# EAGLE schematic BlingBling v1 (EAGLE 6.1)
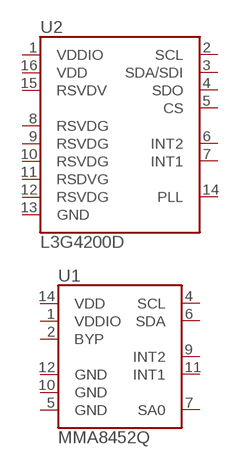
[diagram p0: schematic, sheet 1]

## Parts
U1  MMA8452Q  [QFN-16_0.5MM]
U2  L3G4200D  [LGA16-4X4]
Unconnected: U1.1(VDDIO) U1.2(BYP) U1.4(SCL) U1.5(GND) U1.6(SDA) U1.7(SA0) U1.9(INT2) U1.10(GND) U1.11(INT1) U1.12(GND) U1.14(VDD) U2.1(VDDIO) U2.2(SCL) U2.3(SDA/SDI) U2.4(SDO) U2.5(CS) U2.6(INT2) U2.7(INT1) U2.8(RSVDG) U2.9(RSVDG) U2.10(RSVDG) U2.11(RSDVG) U2.12(RSVDG) U2.13(GND) U2.14(PLL) U2.15(RSVDV) U2.16(VDD)

## Library data of the parts
U1 = SparkFun-Sensors:MMA8452Q: MMA8452Q 3-Axis, 12/8-bit Digital Accelerometer Supply Voltage: 1.6-3.6V Range: +/- 2g, 4g, 8g Interface: I2C, 12-bit and 8-bit ODR: 1.56 Hz - 800 Hz Package: QFN-16 http://cache.freescale.com/files/sensors/doc/data_sheet/MMA8452Q.pdf
U2 = SparkFun-Sensors:L3G4200D: L3G4200D Three-axis, digital output gyroscope The L3G4200D is a low-power three-axis angular rate sensor, has a full scale of ±250/±500/±2000 dps and is capable of measuring rates with a user-selectable bandwidth. It includes a sensing element and an IC interface capable of providing the measured angular rate to the external world through a digital interface (I2C/SPI). Package: 4x4x1.1 LGA-16 (LGA16-4x4.PAC)